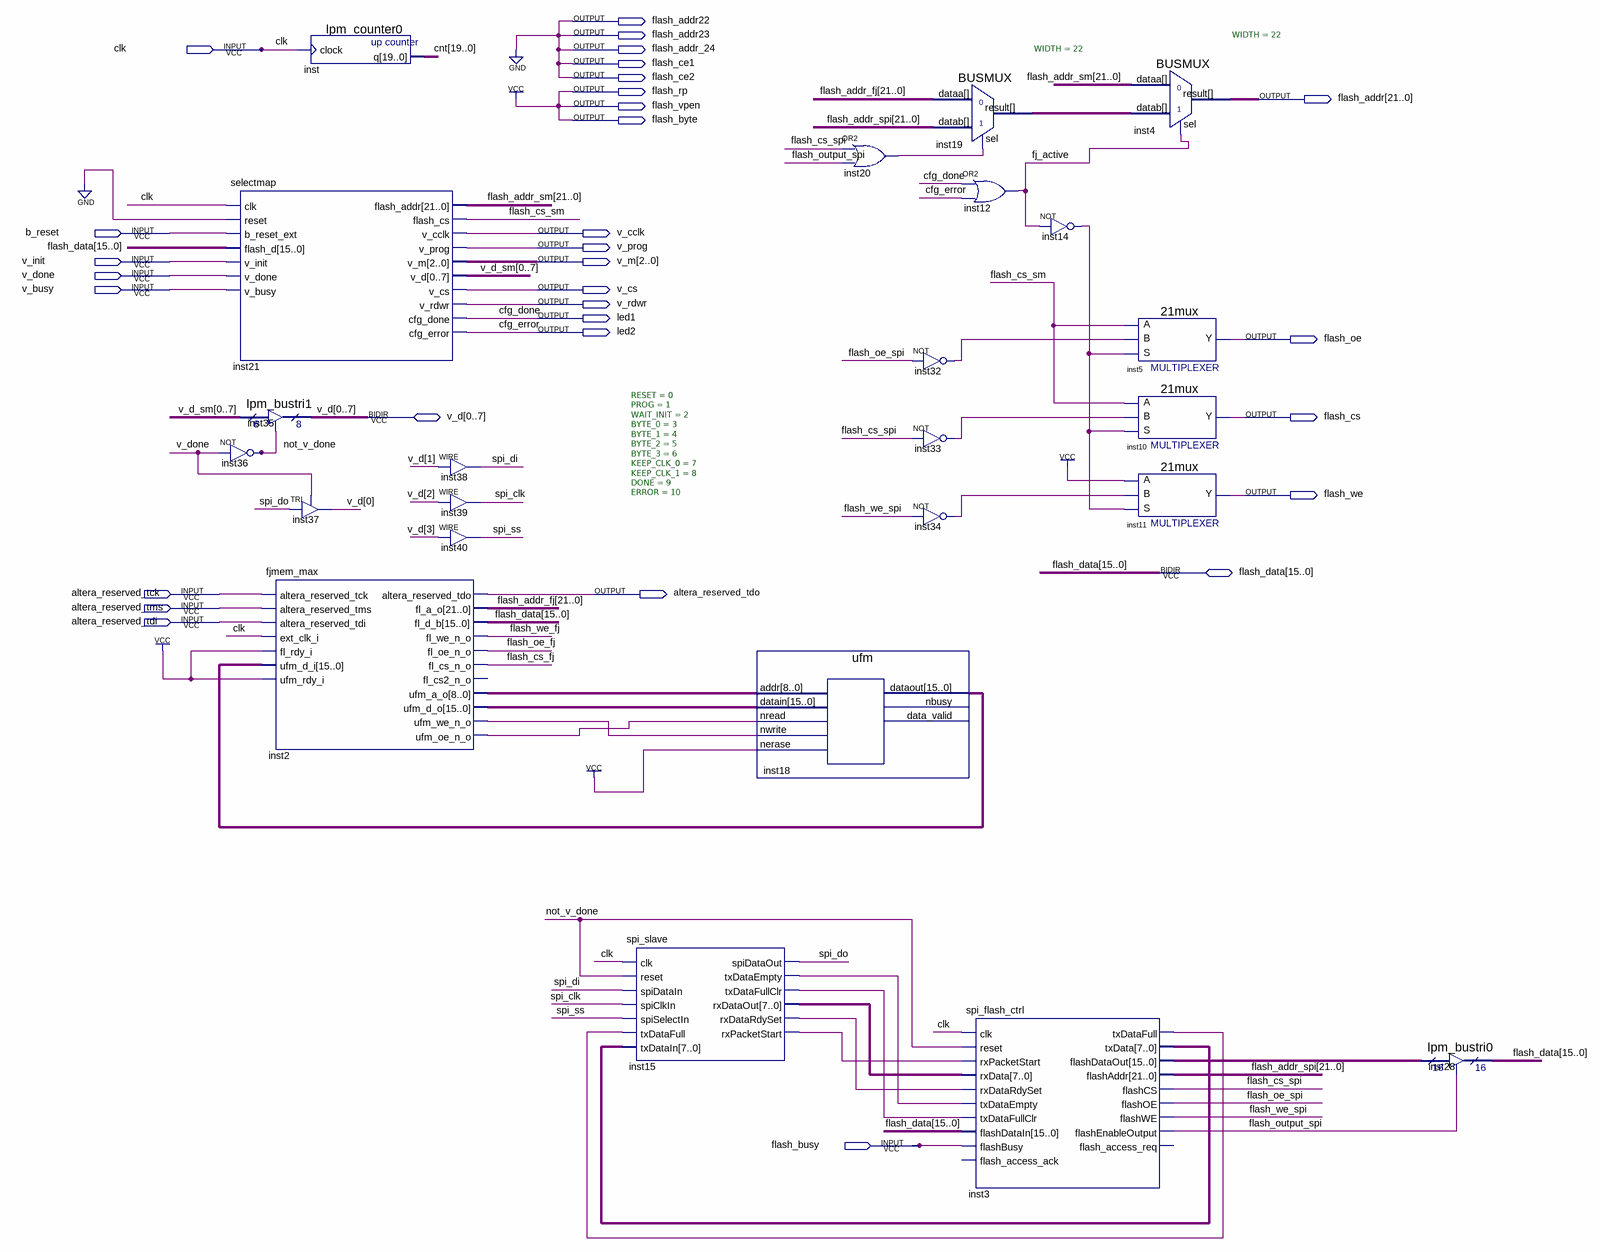
[diagram p0: schematic sheet]
// Quartus schematic vp2.bdf as structural Verilog: 24 symbols, 31 pins
module vp2 (
  input  clk,
  input  b_reset,
  input  v_init,
  input  v_done,
  input  v_busy,
  input  altera_reserved_tck,
  input  altera_reserved_tms,
  input  altera_reserved_tdi,
  input  flash_busy,
  inout  [0:7] v_d,
  inout  [15:0] flash_data,
  output flash_addr22,
  output flash_addr23,
  output flash_addr_24,
  output flash_ce1,
  output flash_ce2,
  output flash_rp,
  output [21:0] flash_addr,
  output flash_vpen,
  output flash_byte,
  output v_cclk,
  output v_prog,
  output [2:0] v_m,
  output v_cs,
  output v_rdwr,
  output led1,
  output led2,
  output flash_oe,
  output flash_cs,
  output flash_we,
  output altera_reserved_tdo
);

  wire fj_active, flash_cs_fj, flash_cs_sm, flash_cs_spi, flash_oe_fj, flash_oe_spi, flash_output_spi,
       flash_we_fj, flash_we_spi, inst2_ufm_oe_n_o, inst2_ufm_we_n_o, inst3_txdatafull, inst14_out,
       inst15_rxdatardyset, inst15_rxpacketstart, inst15_txdataempty, inst15_txdatafullclr, inst20_out,
       inst32_out, inst33_out, inst34_out, not_v_done, spi_clk, spi_di, spi_do, spi_ss;
  wire [7:0] inst3_txdata, inst15_rxdataout, v_d_sm;
  wire [8:0] inst2_ufm_a_o;
  wire [15:0] inst2_ufm_d_o, inst3_flashdataout, inst18_dataout;
  wire [19:0] cnt;
  wire [21:0] flash_addr_fj, flash_addr_sm, flash_addr_spi, inst19_result;

  selectmap #(.RESET(0), .PROG(1), .WAIT_INIT(2), .BYTE_0(3), .BYTE_1(4), .BYTE_2(5), .BYTE_3(6), .KEEP_CLK_0(7), .KEEP_CLK_1(8), .DONE(9), .ERROR(10)) inst21 (
    .clk(clk), .reset(1'b0), .b_reset_ext(b_reset), .flash_d(flash_data), .v_init(v_init), .v_done(v_done),
    .v_busy(v_busy), .flash_addr(flash_addr_sm), .flash_cs(flash_cs_sm), .v_cclk(v_cclk), .v_prog(v_prog),
    .v_m(v_m),
    .v_d({v_d_sm[0], v_d_sm[1], v_d_sm[2], v_d_sm[3], v_d_sm[4], v_d_sm[5], v_d_sm[6], v_d_sm[7]}),
    .v_cs(v_cs), .v_rdwr(v_rdwr), .cfg_done(led1), .cfg_error(led2));
  lpm_bustri1 inst35 (
    .enabledt(not_v_done),
    .data({v_d_sm[0], v_d_sm[1], v_d_sm[2], v_d_sm[3], v_d_sm[4], v_d_sm[5], v_d_sm[6], v_d_sm[7]}),
    .tridata(v_d));
  not inst36 (not_v_done, v_done);
  fjmem_max inst2 (
    .altera_reserved_tck(altera_reserved_tck), .altera_reserved_tms(altera_reserved_tms),
    .altera_reserved_tdi(altera_reserved_tdi), .ext_clk_i(clk), .fl_rdy_i(1'b1), .ufm_d_i(inst18_dataout),
    .ufm_rdy_i(1'b1), .altera_reserved_tdo(altera_reserved_tdo), .fl_a_o(flash_addr_fj),
    .fl_we_n_o(flash_we_fj), .fl_oe_n_o(flash_oe_fj), .fl_cs_n_o(flash_cs_fj), .ufm_a_o(inst2_ufm_a_o),
    .ufm_d_o(inst2_ufm_d_o), .ufm_we_n_o(inst2_ufm_we_n_o), .ufm_oe_n_o(inst2_ufm_oe_n_o), .fl_d_b(flash_data));  // open: fl_cs2_n_o
  lpm_counter0 inst (.clock(clk), .q(cnt));
  TRI inst37 (.IN(spi_do), .OE(v_done), .OUT(v_d[0]));
  assign spi_di = v_d[1];  // WIRE inst38
  assign spi_clk = v_d[2];  // WIRE inst39
  assign spi_ss = v_d[3];  // WIRE inst40
  spi_slave inst15 (
    .clk(clk), .reset(not_v_done), .spiDataIn(spi_di), .spiClkIn(spi_clk), .spiSelectIn(spi_ss),
    .txDataFull(inst3_txdatafull), .txDataIn(inst3_txdata), .spiDataOut(spi_do),
    .txDataEmpty(inst15_txdataempty), .txDataFullClr(inst15_txdatafullclr), .rxDataOut(inst15_rxdataout),
    .rxDataRdySet(inst15_rxdatardyset), .rxPacketStart(inst15_rxpacketstart));
  ufm inst18 (
    .addr(inst2_ufm_a_o), .datain(inst2_ufm_d_o), .nread(inst2_ufm_oe_n_o), .nwrite(inst2_ufm_we_n_o),
    .nerase(1'b1), .dataout(inst18_dataout));  // open: nbusy, data_valid
  or inst20 (inst20_out, flash_cs_spi, flash_output_spi);
  BUSMUX #(.WIDTH(22)) inst19 (.datab(flash_addr_spi), .sel(inst20_out), .dataa(flash_addr_fj), .result(inst19_result));
  not inst32 (inst32_out, flash_oe_spi);
  not inst33 (inst33_out, flash_cs_spi);
  not inst34 (inst34_out, flash_we_spi);
  or inst12 (fj_active, led1, led2);
  spi_flash_ctrl inst3 (
    .clk(clk), .reset(not_v_done), .rxPacketStart(inst15_rxpacketstart), .rxData(inst15_rxdataout),
    .rxDataRdySet(inst15_rxdatardyset), .txDataEmpty(inst15_txdataempty),
    .txDataFullClr(inst15_txdatafullclr), .flashDataIn(flash_data), .flashBusy(flash_busy),
    .txDataFull(inst3_txdatafull), .txData(inst3_txdata), .flashDataOut(inst3_flashdataout),
    .flashAddr(flash_addr_spi), .flashCS(flash_cs_spi), .flashOE(flash_oe_spi), .flashWE(flash_we_spi),
    .flashEnableOutput(flash_output_spi));  // open: flash_access_ack, flash_access_req
  not inst14 (inst14_out, fj_active);
  BUSMUX #(.WIDTH(22)) inst4 (.datab(inst19_result), .sel(fj_active), .dataa(flash_addr_sm), .result(flash_addr));
  \21mux  inst5 (.S(inst14_out), .B(inst32_out), .A(flash_cs_sm), .Y(flash_oe));
  \21mux  inst10 (.S(inst14_out), .B(inst33_out), .A(flash_cs_sm), .Y(flash_cs));
  \21mux  inst11 (.S(inst14_out), .B(inst34_out), .A(1'b1), .Y(flash_we));
  lpm_bustri0 inst28 (.enabledt(flash_output_spi), .data(inst3_flashdataout), .tridata(flash_data));

  assign flash_addr22 = 1'b0;
  assign flash_addr23 = 1'b0;
  assign flash_addr_24 = 1'b0;
  assign flash_byte = 1'b1;
  assign flash_ce1 = 1'b0;
  assign flash_ce2 = 1'b0;
  assign flash_rp = 1'b1;
  assign flash_vpen = 1'b1;

  // Other names for the same wires on the sheet: cfg_done = led1; cfg_error = led2
endmodule
